# Altium project module_pcb_template.PrjPcb
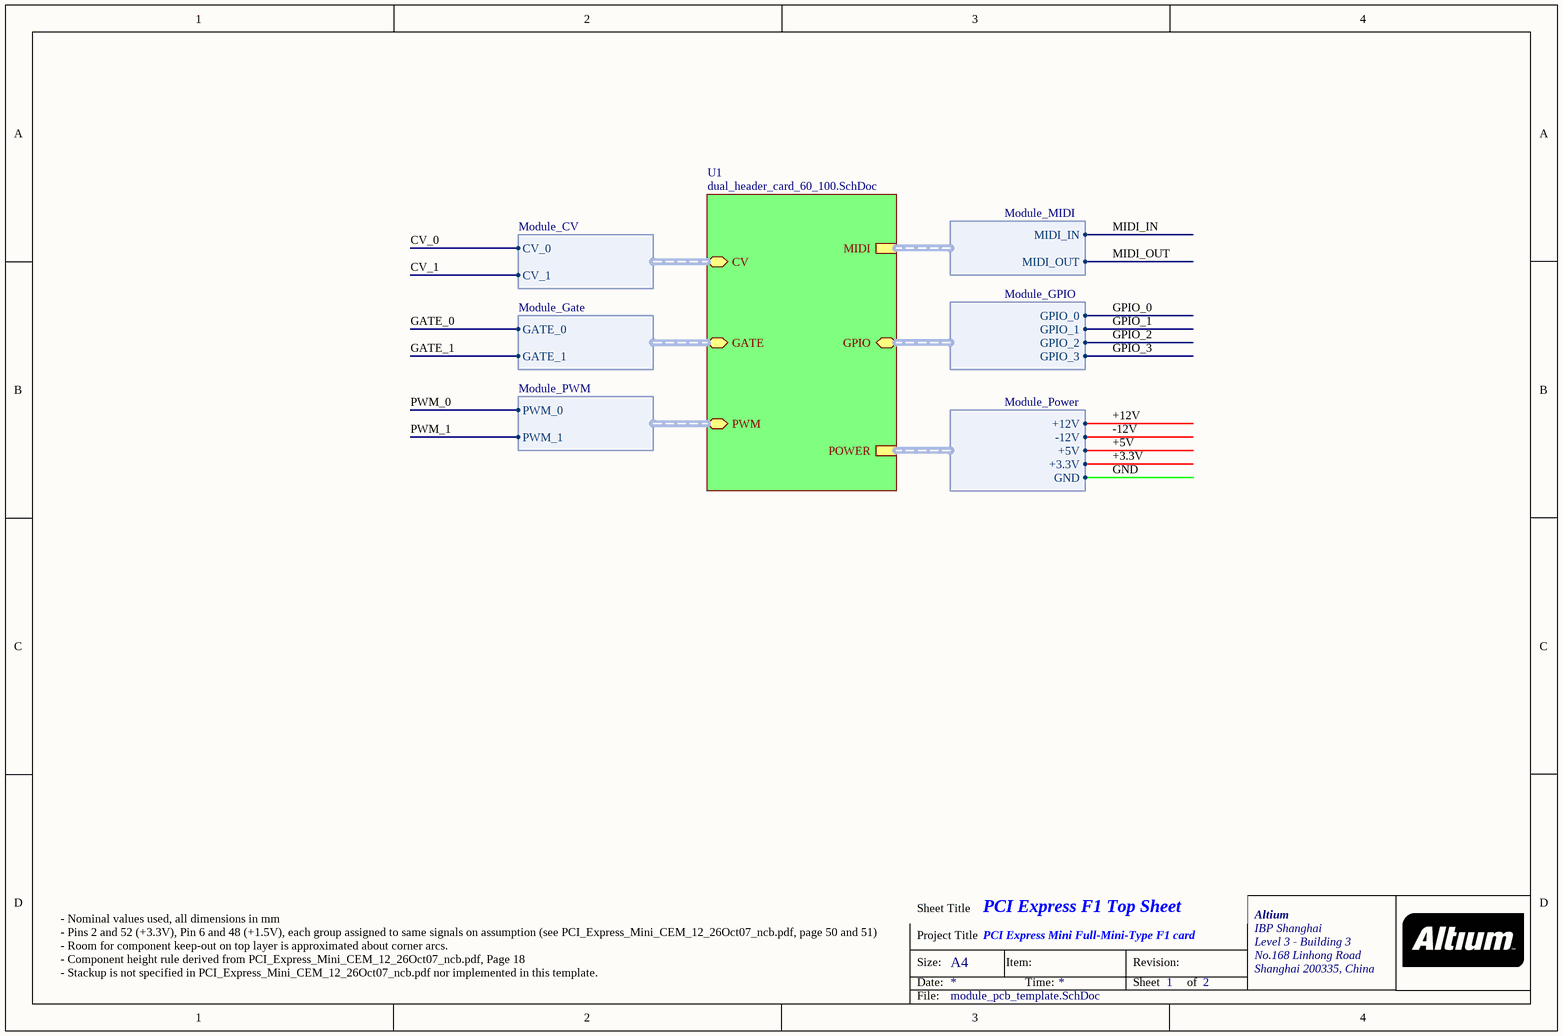
[diagram p0: module_pcb_template.SchDoc]
ProjectAddress1: IBP Shanghai; ProjectAddress2: Level 3 - Building 3; ProjectAddress3: No.168 Linhong Road; ProjectAddress4: Shanghai 200335, China; ProjectOrganization: Altium; ProjectTitle: PCI Express Mini Full-Mini-Type F1 card; Template Family: PCI Express Mini; Template Notes: - Nominal values used, all dimensions in mm  - Pins 2 and 52 (+3.3V), Pin 6 and 48 (+1.5V), each group assigned to same signals on assumption (see PCI_Express_Mini_CEM_12_26Oct07_ncb.pdf, page 50 and 51)  - Room for component keep-out on top layer is approximated about corner arcs.  - Component height rule derived from PCI_Express_Mini_CEM_12_26Oct07_ncb.pdf, Page 18  - Stackup is not specified in PCI_Express_Mini_CEM_12_26Oct07_ncb.pdf nor implemented in this template.; Template Revision Date: Nov 9, 2010; Template Source Document: Outline: PCI_Express_Mini_CEM_12_26Oct07_ncb.pdf Pinout: PCI_Express_Mini_CEM_12_26Oct07_ncb.pdf; Template Source Name: PCI Express Mini CEM 1.2; Template Source Organization: PCI-SIG; Template Source Revision Date: rev 1.2, Oct 26, 2007; Template Source URL: http://www.pcisig.com/members/downloads/specifications/pciexpress/PCI_Express_Mini_CEM_12_26Oct07_ncb.pdf
3 sheets, 29 parts. Net scope: hierarchical (ports join the sheet entries above them; power ports are global).
Board file: module_pcb_template.PcbDoc
Sheets:
  module_pcb_template.SchDoc
    U1 = dual_header_card_60_100.SchDoc
      U? = GARY_Backplane_ModuleSlot_CurrentBuffer.SchDoc

## Sheet module_pcb_template.SchDoc: PCI Express F1 Top Sheet
size A4; SheetNumber: 1; SheetTotal: 2

### Sub-sheets
U1 = dual_header_card_60_100.SchDoc: POWER (harness Module_Power), MIDI (harness Module_MIDI), CV (harness Module_CV), GPIO (harness Module_GPIO), GATE (harness Module_Gate), PWM (harness Module_PWM)

### Harnesses
Module_Power: +12V, +5V, GND, +3.3V, -12V
Module_MIDI: MIDI_IN, MIDI_OUT
Module_GPIO: GPIO_0, GPIO_1, GPIO_2, GPIO_3
Module_PWM: PWM_0, PWM_1
Module_CV: CV_0, CV_1
Module_Gate: GATE_0, GATE_1

### Notes on the sheet
- - Nominal values used, all dimensions in mm
  - Pins 2 and 52 (+3.3V), Pin 6 and 48 (+1.5V), each group assigned to same signals on assumption (see PCI_Express_Mini_CEM_12_26Oct07_ncb.pdf, page 50 and 51)
  - Room for component keep-out on top layer is approximated about corner arcs.
  - Component height rule derived from PCI_Express_Mini_CEM_12_26Oct07_ncb.pdf, Page 18
  - Stackup is not specified in PCI_Express_Mini_CEM_12_26Oct07_ncb.pdf nor implemented in this template.
- Sheet Title
- Project Title
- Size:
- Date:
- A4
- Item:
- Time:
- Revision:
- Sheet
- of
- File:

## Sheet dual_header_card_60_100.SchDoc: PCI Express Mini 52Pin
size OrCAD B
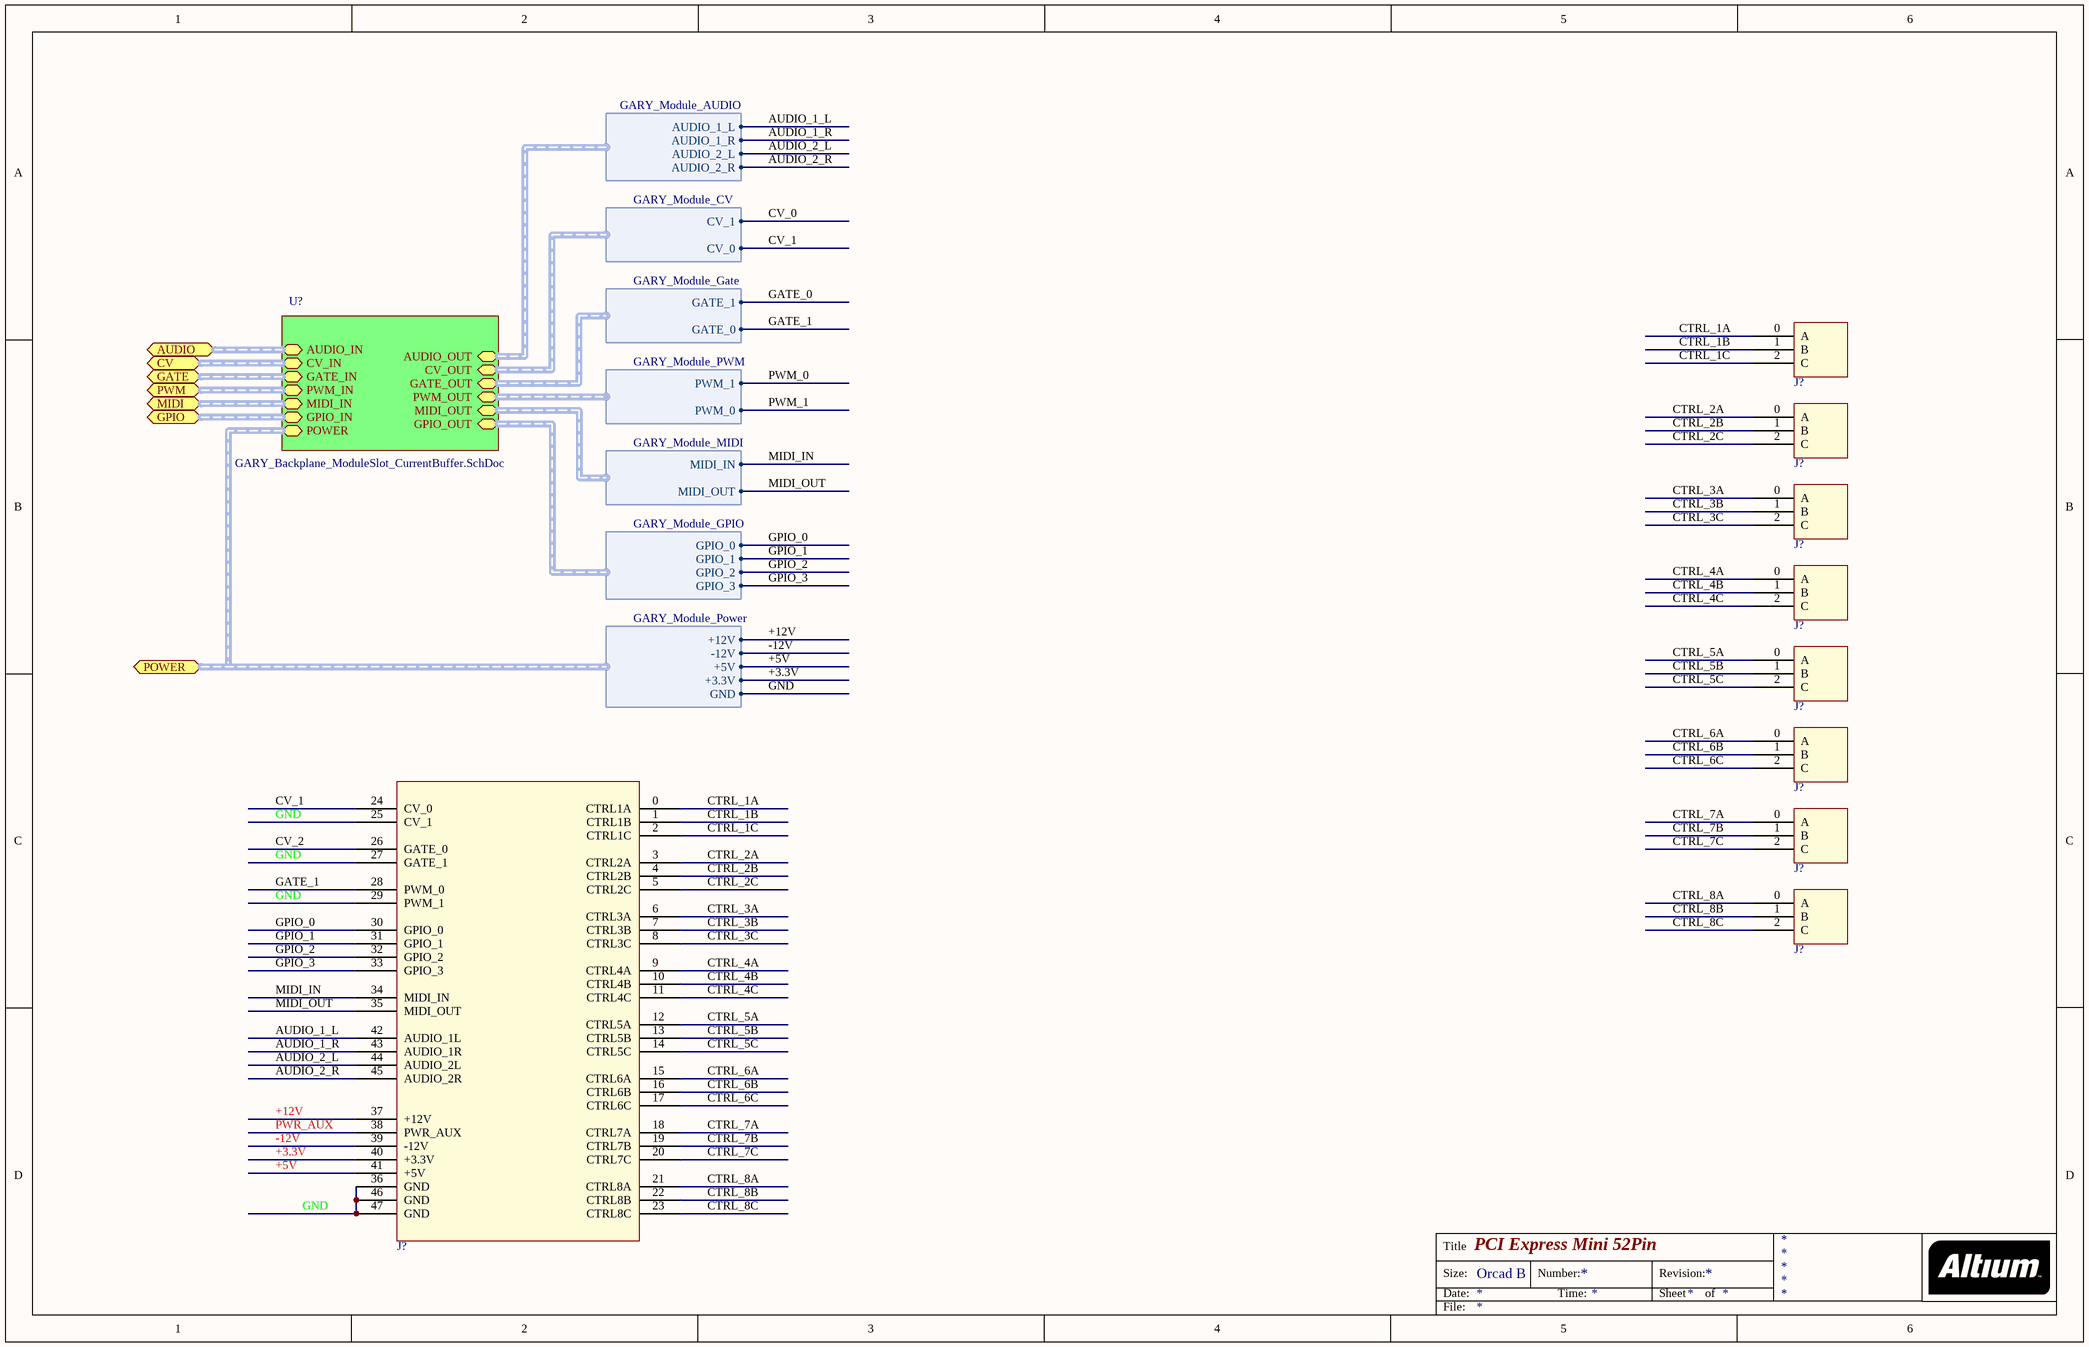
[diagram p1: dual_header_card_60_100.SchDoc]

### Parts
(Parts that share a designator on the sheet are numbered #1, #2 ... from top to bottom, then left to right.)
J?#1  CTRL_INPUT_Generic  [CTRL_INPUT]  (value not drawn)
J?#2  CTRL_INPUT_Generic  [CTRL_INPUT]  (value not drawn)
J?#3  CTRL_INPUT_Generic  [CTRL_INPUT]  (value not drawn)
J?#4  CTRL_INPUT_Generic  [CTRL_INPUT]  (value not drawn)
J?#5  CTRL_INPUT_Generic  [CTRL_INPUT]  (value not drawn)
J?#6  CTRL_INPUT_Generic  [CTRL_INPUT]  (value not drawn)
J?#7  CTRL_INPUT_Generic  [CTRL_INPUT]  (value not drawn)
J?#8  CTRL_INPUT_Generic  [CTRL_INPUT]  (value not drawn)
J?#9  MODULE  [MODULE]  (value not drawn)

### Sub-sheets
U? = GARY_Backplane_ModuleSlot_CurrentBuffer.SchDoc: CV_IN (harness GARY_Module_CV), GATE_IN (harness GARY_Module_Gate), PWM_IN (harness GARY_Module_PWM), MIDI_IN (harness GARY_Module_MIDI), GPIO_IN (harness GARY_Module_MIDI), CV_OUT (harness GARY_Module_CV), GATE_OUT (harness GARY_Module_Gate), PWM_OUT (harness GARY_Module_PWM), MIDI_OUT (harness GARY_Module_MIDI), GPIO_OUT (harness GARY_Module_GPIO), POWER (harness GARY_Module_Power), AUDIO_IN (harness GARY_Module_AUDIO), AUDIO_OUT (harness GARY_Module_AUDIO)

### Ports
AUDIO (harness GARY_Module_AUDIO), CV (harness GARY_Module_CV), GATE (harness GARY_Module_Gate), GPIO (harness GARY_Module_GPIO), MIDI (harness GARY_Module_MIDI), POWER (harness GARY_Module_Power), PWM (harness GARY_Module_PWM)

### Harnesses
GARY_Module_Power: +12V, +5V, GND, +3.3V, -12V
GARY_Module_MIDI: MIDI_IN, MIDI_OUT
GARY_Module_GPIO: GPIO_0, GPIO_1, GPIO_2, GPIO_3
GARY_Module_PWM: PWM_0, PWM_1
GARY_Module_CV: CV_0, CV_1
GARY_Module_Gate: GATE_0, GATE_1
GARY_Module_AUDIO: AUDIO_1_L, AUDIO_1_R, AUDIO_2_R, AUDIO_2_L

### Nets
+3.3V: J?#9.40(+3.3V) ; port POWER.+3.3V
+5V: J?#9.41(+5V) ; port POWER.+5V
+12V: J?#9.37(+12V) ; port POWER.+12V
-12V: J?#9.39(-12V) ; port POWER.-12V
AUDIO_1_L: J?#9.42(AUDIO_1L) ; sheet U?/AUDIO_OUT.AUDIO_1_L
AUDIO_1_R: J?#9.43(AUDIO_1R) ; sheet U?/AUDIO_OUT.AUDIO_1_R
AUDIO_2_L: J?#9.44(AUDIO_2L) ; sheet U?/AUDIO_OUT.AUDIO_2_L
AUDIO_2_R: J?#9.45(AUDIO_2R) ; sheet U?/AUDIO_OUT.AUDIO_2_R
CTRL_1A: J?#1.0(A) J?#9.0(CTRL1A)
CTRL_1B: J?#1.1(B) J?#9.1(CTRL1B)
CTRL_1C: J?#1.2(C) J?#9.2(CTRL1C)
CTRL_2A: J?#2.0(A) J?#9.3(CTRL2A)
CTRL_2B: J?#2.1(B) J?#9.4(CTRL2B)
CTRL_2C: J?#2.2(C) J?#9.5(CTRL2C)
CTRL_3A: J?#3.0(A) J?#9.6(CTRL3A)
CTRL_3B: J?#3.1(B) J?#9.7(CTRL3B)
CTRL_3C: J?#3.2(C) J?#9.8(CTRL3C)
CTRL_4A: J?#4.0(A) J?#9.9(CTRL4A)
CTRL_4B: J?#4.1(B) J?#9.10(CTRL4B)
CTRL_4C: J?#4.2(C) J?#9.11(CTRL4C)
CTRL_5A: J?#5.0(A) J?#9.12(CTRL5A)
CTRL_5B: J?#5.1(B) J?#9.13(CTRL5B)
CTRL_5C: J?#5.2(C) J?#9.14(CTRL5C)
CTRL_6A: J?#6.0(A) J?#9.15(CTRL6A)
CTRL_6B: J?#6.1(B) J?#9.16(CTRL6B)
CTRL_6C: J?#6.2(C) J?#9.17(CTRL6C)
CTRL_7A: J?#7.0(A) J?#9.18(CTRL7A)
CTRL_7B: J?#7.1(B) J?#9.19(CTRL7B)
CTRL_7C: J?#7.2(C) J?#9.20(CTRL7C)
CTRL_8A: J?#8.0(A) J?#9.21(CTRL8A)
CTRL_8B: J?#8.1(B) J?#9.22(CTRL8B)
CTRL_8C: J?#8.2(C) J?#9.23(CTRL8C)
CV_1: J?#9.24(CV_0) ; sheet U?/CV_OUT.CV_0  [project net CV_0_BUF]
CV_2: J?#9.26(GATE_0)
GATE_1: J?#9.28(PWM_0) ; sheet U?/GATE_OUT.GATE_0  [project net GATE_0_BUF]
GND: J?#9.25(CV_1) J?#9.27(GATE_1) J?#9.29(PWM_1) J?#9.36(GND) J?#9.46(GND) J?#9.47(GND) ; port POWER.GND
GPIO_0: J?#9.30(GPIO_0) ; sheet U?/GPIO_OUT.GPIO_0
GPIO_1: J?#9.31(GPIO_1) ; sheet U?/GPIO_OUT.GPIO_1
GPIO_2: J?#9.32(GPIO_2) ; sheet U?/GPIO_OUT.GPIO_2
GPIO_3: J?#9.33(GPIO_3) ; sheet U?/GPIO_OUT.GPIO_3
MIDI_IN: J?#9.34(MIDI_IN) ; sheet U?/MIDI_OUT.MIDI_IN
MIDI_OUT: J?#9.35(MIDI_OUT) ; sheet U?/MIDI_OUT.MIDI_OUT
PWR_AUX: J?#9.38(PWR_AUX)

### Buses and harness runs
harness port AUDIO = sheet U?/AUDIO_IN
harness port CV = sheet U?/CV_IN
harness port GATE = sheet U?/GATE_IN
harness port GPIO = sheet U?/GPIO_IN
harness port MIDI = sheet U?/MIDI_IN
harness port POWER = sheet U?/POWER
harness port PWM = sheet U?/PWM_IN

### Notes on the sheet
- Title
- Size:
- Date:
- Orcad B
- Number:
- Time:
- Revision:
- Sheet
- of
- File:

### Library data of the parts
J?#1-J?#8 = CTRL_INPUT_Generic: GARY Synthesizer - Generic Control Input
J?#9 = MODULE: GARY Synthesizer - Module Footprint

## Sheet GARY_Backplane_ModuleSlot_CurrentBuffer.SchDoc
size A3
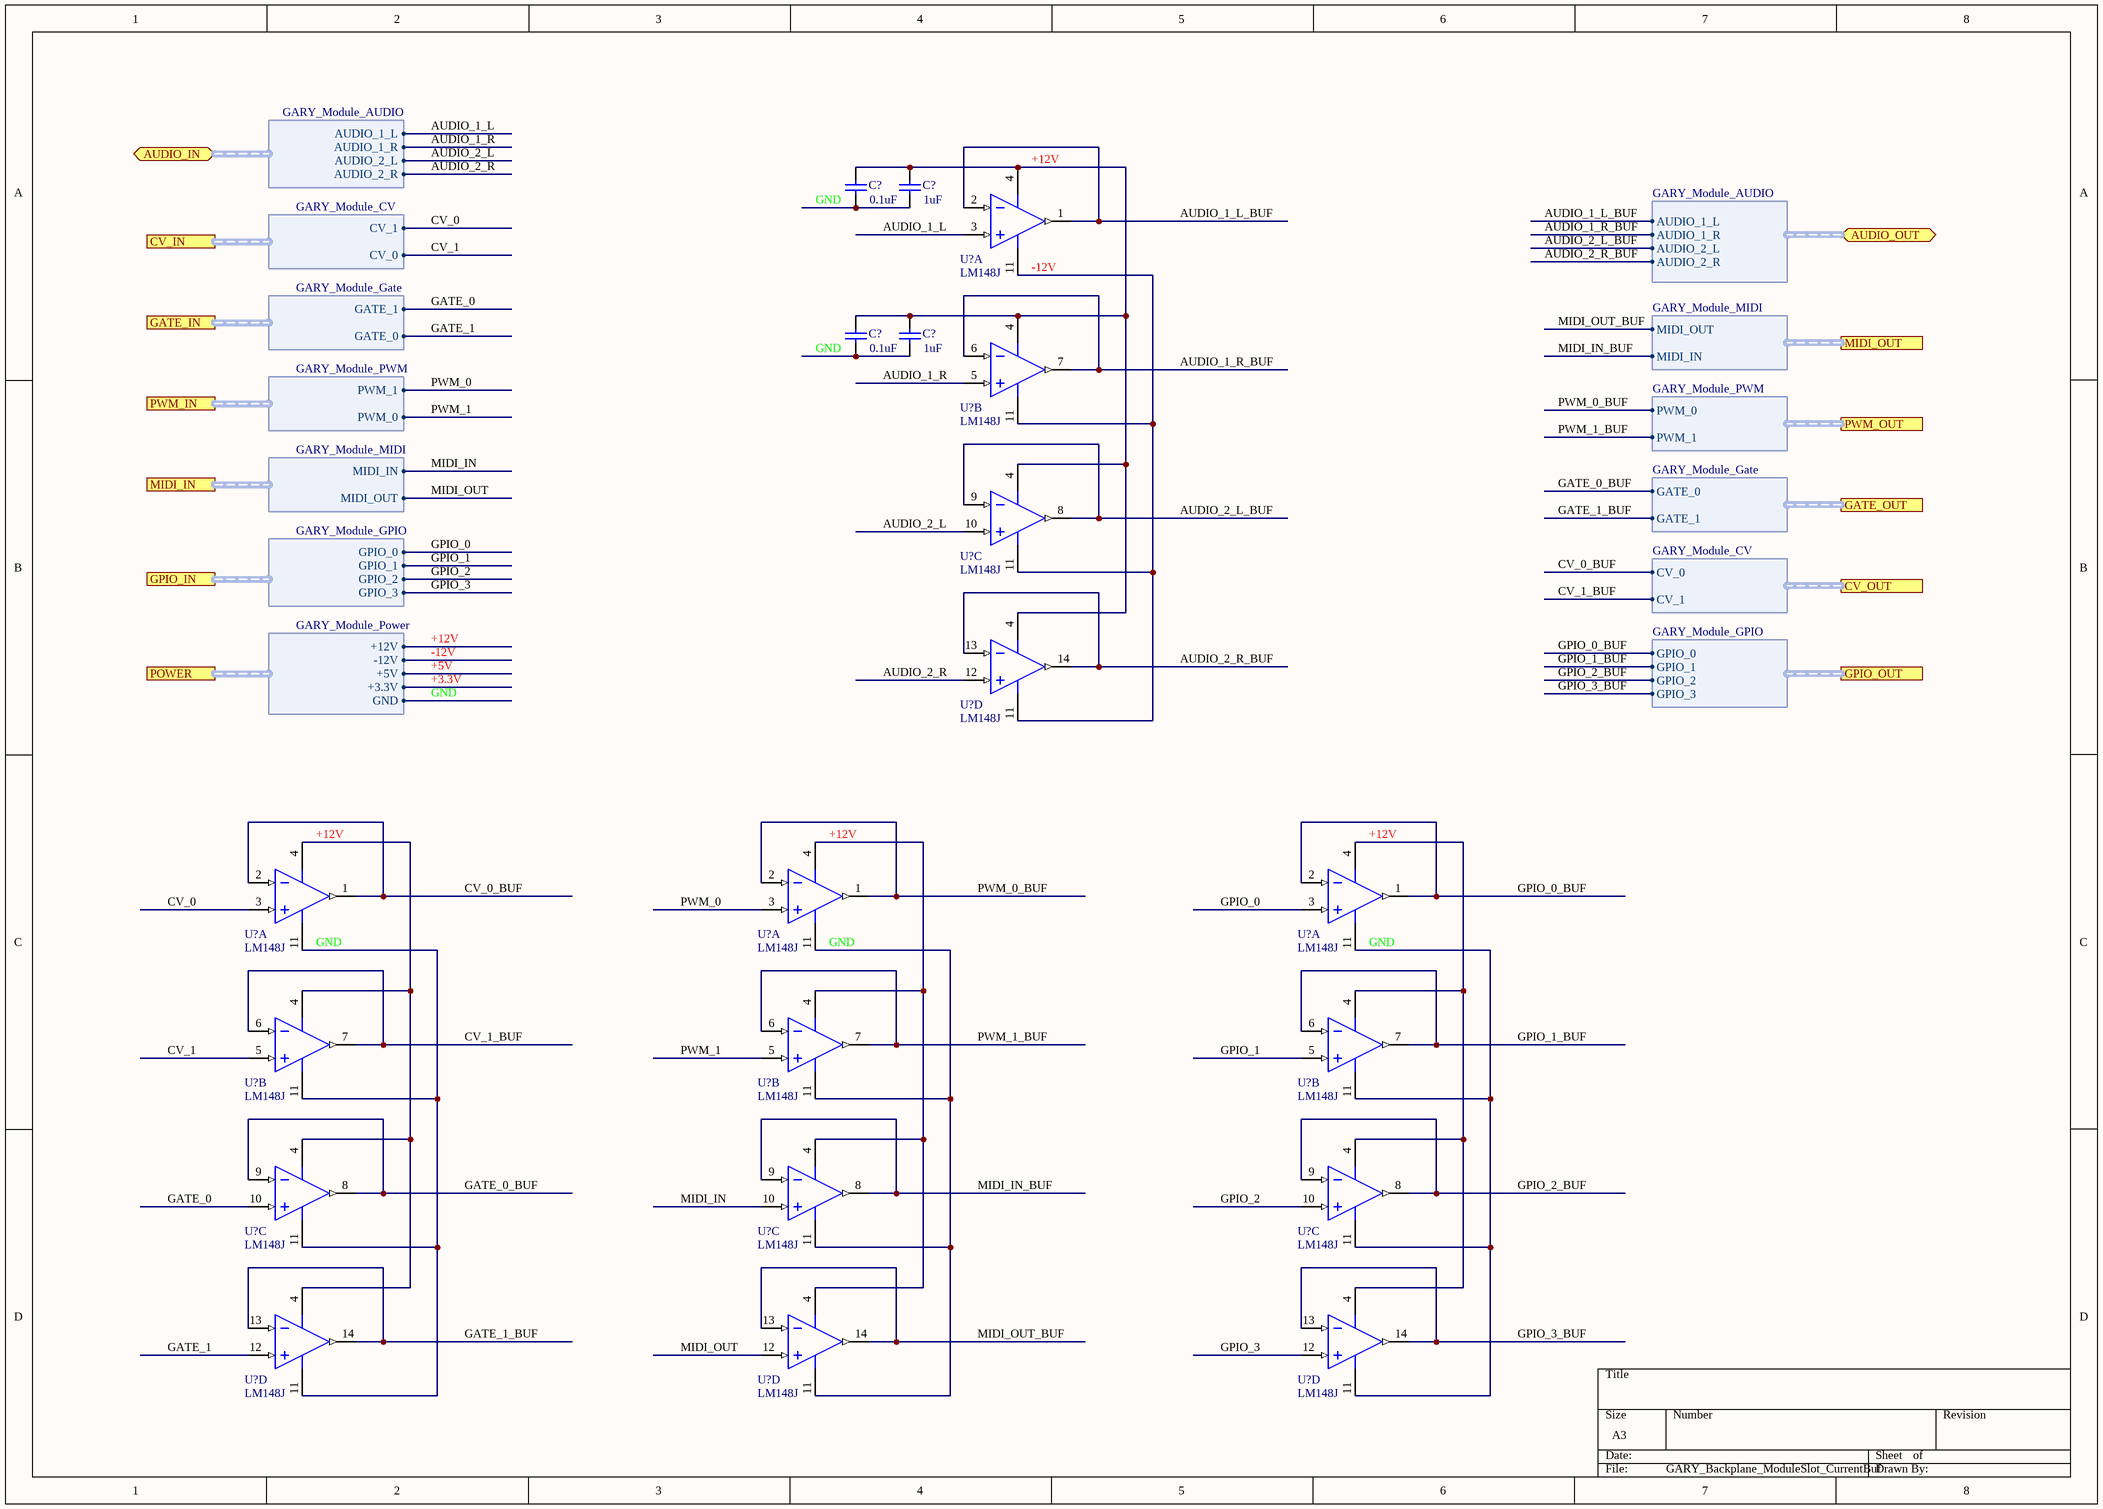
[diagram p2: GARY_Backplane_ModuleSlot_CurrentBuffer.SchDoc]

### Parts
(Parts that share a designator on the sheet are numbered #1, #2 ... from top to bottom, then left to right.)
C?#1  value 0.1uF  [RAD-0.3]  (hidden comment: Cap)
C?#2  value 1uF  [RAD-0.3]  (hidden comment: Cap)
C?#3  value 0.1uF  [RAD-0.3]  (hidden comment: Cap)
C?#4  value 1uF  [RAD-0.3]  (hidden comment: Cap)
U?#1  LM148J  [J14A]  (part A of 4)
U?#2  LM148J  [J14A]  (part B of 4)
U?#3  LM148J  [J14A]  (part C of 4)
U?#4  LM148J  [J14A]  (part D of 4)
U?#5  LM148J  [J14A]  (part A of 4)
U?#6  LM148J  [J14A]  (part A of 4)
U?#7  LM148J  [J14A]  (part A of 4)
U?#8  LM148J  [J14A]  (part B of 4)
U?#9  LM148J  [J14A]  (part B of 4)
U?#10  LM148J  [J14A]  (part B of 4)
U?#11  LM148J  [J14A]  (part C of 4)
U?#12  LM148J  [J14A]  (part C of 4)
U?#13  LM148J  [J14A]  (part C of 4)
U?#14  LM148J  [J14A]  (part D of 4)
U?#15  LM148J  [J14A]  (part D of 4)
U?#16  LM148J  [J14A]  (part D of 4)

### Ports
AUDIO_IN (harness GARY_Module_AUDIO), AUDIO_OUT (harness GARY_Module_AUDIO), CV_IN (harness GARY_Module_CV), CV_OUT (harness GARY_Module_CV), GATE_IN (harness GARY_Module_Gate), GATE_OUT (harness GARY_Module_Gate), GPIO_IN (harness GARY_Module_GPIO), GPIO_OUT (harness GARY_Module_GPIO), MIDI_IN (harness GARY_Module_MIDI), MIDI_OUT (harness GARY_Module_MIDI), POWER (harness GARY_Module_Power), PWM_IN (harness GARY_Module_PWM), PWM_OUT (harness GARY_Module_PWM)

### Harnesses
GARY_Module_Power: +12V, +5V, GND, +3.3V, -12V
GARY_Module_MIDI: MIDI_IN, MIDI_OUT
GARY_Module_GPIO: GPIO_0, GPIO_1, GPIO_2, GPIO_3
GARY_Module_PWM: PWM_0, PWM_1
GARY_Module_CV: CV_0, CV_1
GARY_Module_Gate: GATE_0, GATE_1
GARY_Module_AUDIO: AUDIO_1_L, AUDIO_1_R, AUDIO_2_R, AUDIO_2_L

### Nets
+12V: C?#1.2 C?#2.2 C?#3.2 C?#4.2 U?#1.4(V+) U?#2.4(V+) U?#3.4(V+) U?#4.4(V+) U?#5.4(V+) U?#6.4(V+) U?#7.4(V+) U?#8.4(V+) U?#9.4(V+) U?#10.4(V+) U?#11.4(V+) U?#12.4(V+) U?#13.4(V+) U?#14.4(V+) U?#15.4(V+) U?#16.4(V+) ; port POWER.+12V
-12V: U?#1.11(V-) U?#2.11(V-) U?#3.11(V-) U?#4.11(V-) ; port POWER.-12V
AUDIO_1_L: U?#1.3(IN1+) ; port AUDIO_IN.AUDIO_1_L
AUDIO_1_L_BUF: U?#1.1(OUT1) U?#1.2(IN1-) ; port AUDIO_OUT.AUDIO_1_L  [project net AUDIO_1_L]
AUDIO_1_R: U?#2.5(IN2+) ; port AUDIO_IN.AUDIO_1_R
AUDIO_1_R_BUF: U?#2.6(IN2-) U?#2.7(OUT2) ; port AUDIO_OUT.AUDIO_1_R  [project net AUDIO_1_R]
AUDIO_2_L: U?#3.10(IN3+) ; port AUDIO_IN.AUDIO_2_L
AUDIO_2_L_BUF: U?#3.8(OUT3) U?#3.9(IN3-) ; port AUDIO_OUT.AUDIO_2_L  [project net AUDIO_2_L]
AUDIO_2_R: U?#4.12(IN4+) ; port AUDIO_IN.AUDIO_2_R
AUDIO_2_R_BUF: U?#4.13(IN4-) U?#4.14(OUT4) ; port AUDIO_OUT.AUDIO_2_R  [project net AUDIO_2_R]
CV_0: U?#5.3(IN1+) ; port CV_IN.CV_1
CV_0_BUF: U?#5.1(OUT1) U?#5.2(IN1-) ; port CV_OUT.CV_0
CV_1: U?#8.5(IN2+) ; port CV_IN.CV_0  [project net CV_0]
CV_1_BUF: U?#8.6(IN2-) U?#8.7(OUT2) ; port CV_OUT.CV_1  [project net CV_0]
GATE_0: U?#11.10(IN3+) ; port GATE_IN.GATE_1
GATE_0_BUF: U?#11.8(OUT3) U?#11.9(IN3-) ; port GATE_OUT.GATE_0
GATE_1: U?#14.12(IN4+) ; port GATE_IN.GATE_0  [project net GATE_0]
GATE_1_BUF: U?#14.13(IN4-) U?#14.14(OUT4) ; port GATE_OUT.GATE_1  [project net GATE_0]
GND: C?#1.1 C?#2.1 C?#3.1 C?#4.1 U?#5.11(V-) U?#6.11(V-) U?#7.11(V-) U?#8.11(V-) U?#9.11(V-) U?#10.11(V-) U?#11.11(V-) U?#12.11(V-) U?#13.11(V-) U?#14.11(V-) U?#15.11(V-) U?#16.11(V-) ; port POWER.GND
GPIO_0: U?#7.3(IN1+) ; port GPIO_IN.GPIO_0
GPIO_0_BUF: U?#7.1(OUT1) U?#7.2(IN1-) ; port GPIO_OUT.GPIO_0  [project net GPIO_0]
GPIO_1: U?#10.5(IN2+) ; port GPIO_IN.GPIO_1
GPIO_1_BUF: U?#10.6(IN2-) U?#10.7(OUT2) ; port GPIO_OUT.GPIO_1  [project net GPIO_1]
GPIO_2: U?#13.10(IN3+) ; port GPIO_IN.GPIO_2
GPIO_2_BUF: U?#13.8(OUT3) U?#13.9(IN3-) ; port GPIO_OUT.GPIO_2  [project net GPIO_2]
GPIO_3: U?#16.12(IN4+) ; port GPIO_IN.GPIO_3
GPIO_3_BUF: U?#16.13(IN4-) U?#16.14(OUT4) ; port GPIO_OUT.GPIO_3  [project net GPIO_3]
MIDI_IN: U?#12.10(IN3+) ; port MIDI_IN.MIDI_IN
MIDI_IN_BUF: U?#12.8(OUT3) U?#12.9(IN3-) ; port MIDI_OUT.MIDI_IN  [project net MIDI_IN]
MIDI_OUT: U?#15.12(IN4+) ; port MIDI_IN.MIDI_OUT
MIDI_OUT_BUF: U?#15.13(IN4-) U?#15.14(OUT4) ; port MIDI_OUT.MIDI_OUT  [project net MIDI_OUT]
PWM_0: U?#6.3(IN1+) ; port PWM_IN.PWM_1
PWM_0_BUF: U?#6.1(OUT1) U?#6.2(IN1-) ; port PWM_OUT.PWM_0
PWM_1: U?#9.5(IN2+) ; port PWM_IN.PWM_0  [project net PWM_0]
PWM_1_BUF: U?#9.6(IN2-) U?#9.7(OUT2) ; port PWM_OUT.PWM_1  [project net PWM_0]

### Library data of the parts
C?#1-C?#4 = Cap: Capacitor; Published: 8-Jun-2000; LatestRevisionDate: 17-Jul-2002; LatestRevisionNote: Re-released for DXP Platform.; PackageReference: RAD-0.3; Publisher: Altium Limited; PackageDescription: Radial Cap, Thru-Hole; 2 Leads; 0.3 in Pin Spacing
U?#1-U?#16 = LM148J: Series Quad 741 Op Amp, 14-pin CerDIP; Manufacturer: National Semiconductor; PackageTopMarking: NSUZXYYTT*LM148J; PowerWise: N; CompType: Amplifiers; High-Reliability: Y; DatasheetVersion: Nov-2003; PackageVersion: revJ, Jul-2002; PackageReference: J14A; PackageDescription: Cerdip, .400 x .310in Body, 14 Lead, .300in Centers, .100in Pitch; PartNumber: LM148J; RoHS: N; PinCount: 14; ComponentLink1Description: Manufacturer URL; ComponentLink1URL: http://www.national.com/; ComponentLink2Description: LM148 Datasheet; ComponentLink2URL: http://www.national.com/ds/LM/LM148.pdf; ComponentLink3Description: LM148 Web Page; ComponentLink3URL: http://www.national.com/pf/LM/LM148.html; ComponentLink4Description: J14A Package Page; ComponentLink4URL: http://www.national.com/packaging/folders/j14a.html

## Nets that join several sheets
+12V: dual_header_card_60_100 (J?#9.37), GARY_Backplane_ModuleSlot_CurrentBuffer (20 pins)
-12V: dual_header_card_60_100 (J?#9.39), GARY_Backplane_ModuleSlot_CurrentBuffer (U?#1.11 U?#2.11 U?#3.11 U?#4.11)
AUDIO_1_L: dual_header_card_60_100 (J?#9.42), GARY_Backplane_ModuleSlot_CurrentBuffer (U?#1.1 U?#1.2)
AUDIO_1_R: dual_header_card_60_100 (J?#9.43), GARY_Backplane_ModuleSlot_CurrentBuffer (U?#2.6 U?#2.7)
AUDIO_2_L: dual_header_card_60_100 (J?#9.44), GARY_Backplane_ModuleSlot_CurrentBuffer (U?#3.8 U?#3.9)
AUDIO_2_R: dual_header_card_60_100 (J?#9.45), GARY_Backplane_ModuleSlot_CurrentBuffer (U?#4.13 U?#4.14)
CV_0_BUF: dual_header_card_60_100 (J?#9.24), GARY_Backplane_ModuleSlot_CurrentBuffer (U?#5.1 U?#5.2)
GATE_0_BUF: dual_header_card_60_100 (J?#9.28), GARY_Backplane_ModuleSlot_CurrentBuffer (U?#11.8 U?#11.9)
GND: dual_header_card_60_100 (6 pins), GARY_Backplane_ModuleSlot_CurrentBuffer (16 pins)
GPIO_0: dual_header_card_60_100 (J?#9.30), GARY_Backplane_ModuleSlot_CurrentBuffer (U?#7.1 U?#7.2)
GPIO_1: dual_header_card_60_100 (J?#9.31), GARY_Backplane_ModuleSlot_CurrentBuffer (U?#10.6 U?#10.7)
GPIO_2: dual_header_card_60_100 (J?#9.32), GARY_Backplane_ModuleSlot_CurrentBuffer (U?#13.8 U?#13.9)
GPIO_3: dual_header_card_60_100 (J?#9.33), GARY_Backplane_ModuleSlot_CurrentBuffer (U?#16.13 U?#16.14)
MIDI_IN: dual_header_card_60_100 (J?#9.34), GARY_Backplane_ModuleSlot_CurrentBuffer (U?#12.8 U?#12.9)
MIDI_OUT: dual_header_card_60_100 (J?#9.35), GARY_Backplane_ModuleSlot_CurrentBuffer (U?#15.13 U?#15.14)